# EAGLE board core+io2 (EAGLE 6.6.0), part 1 of 2
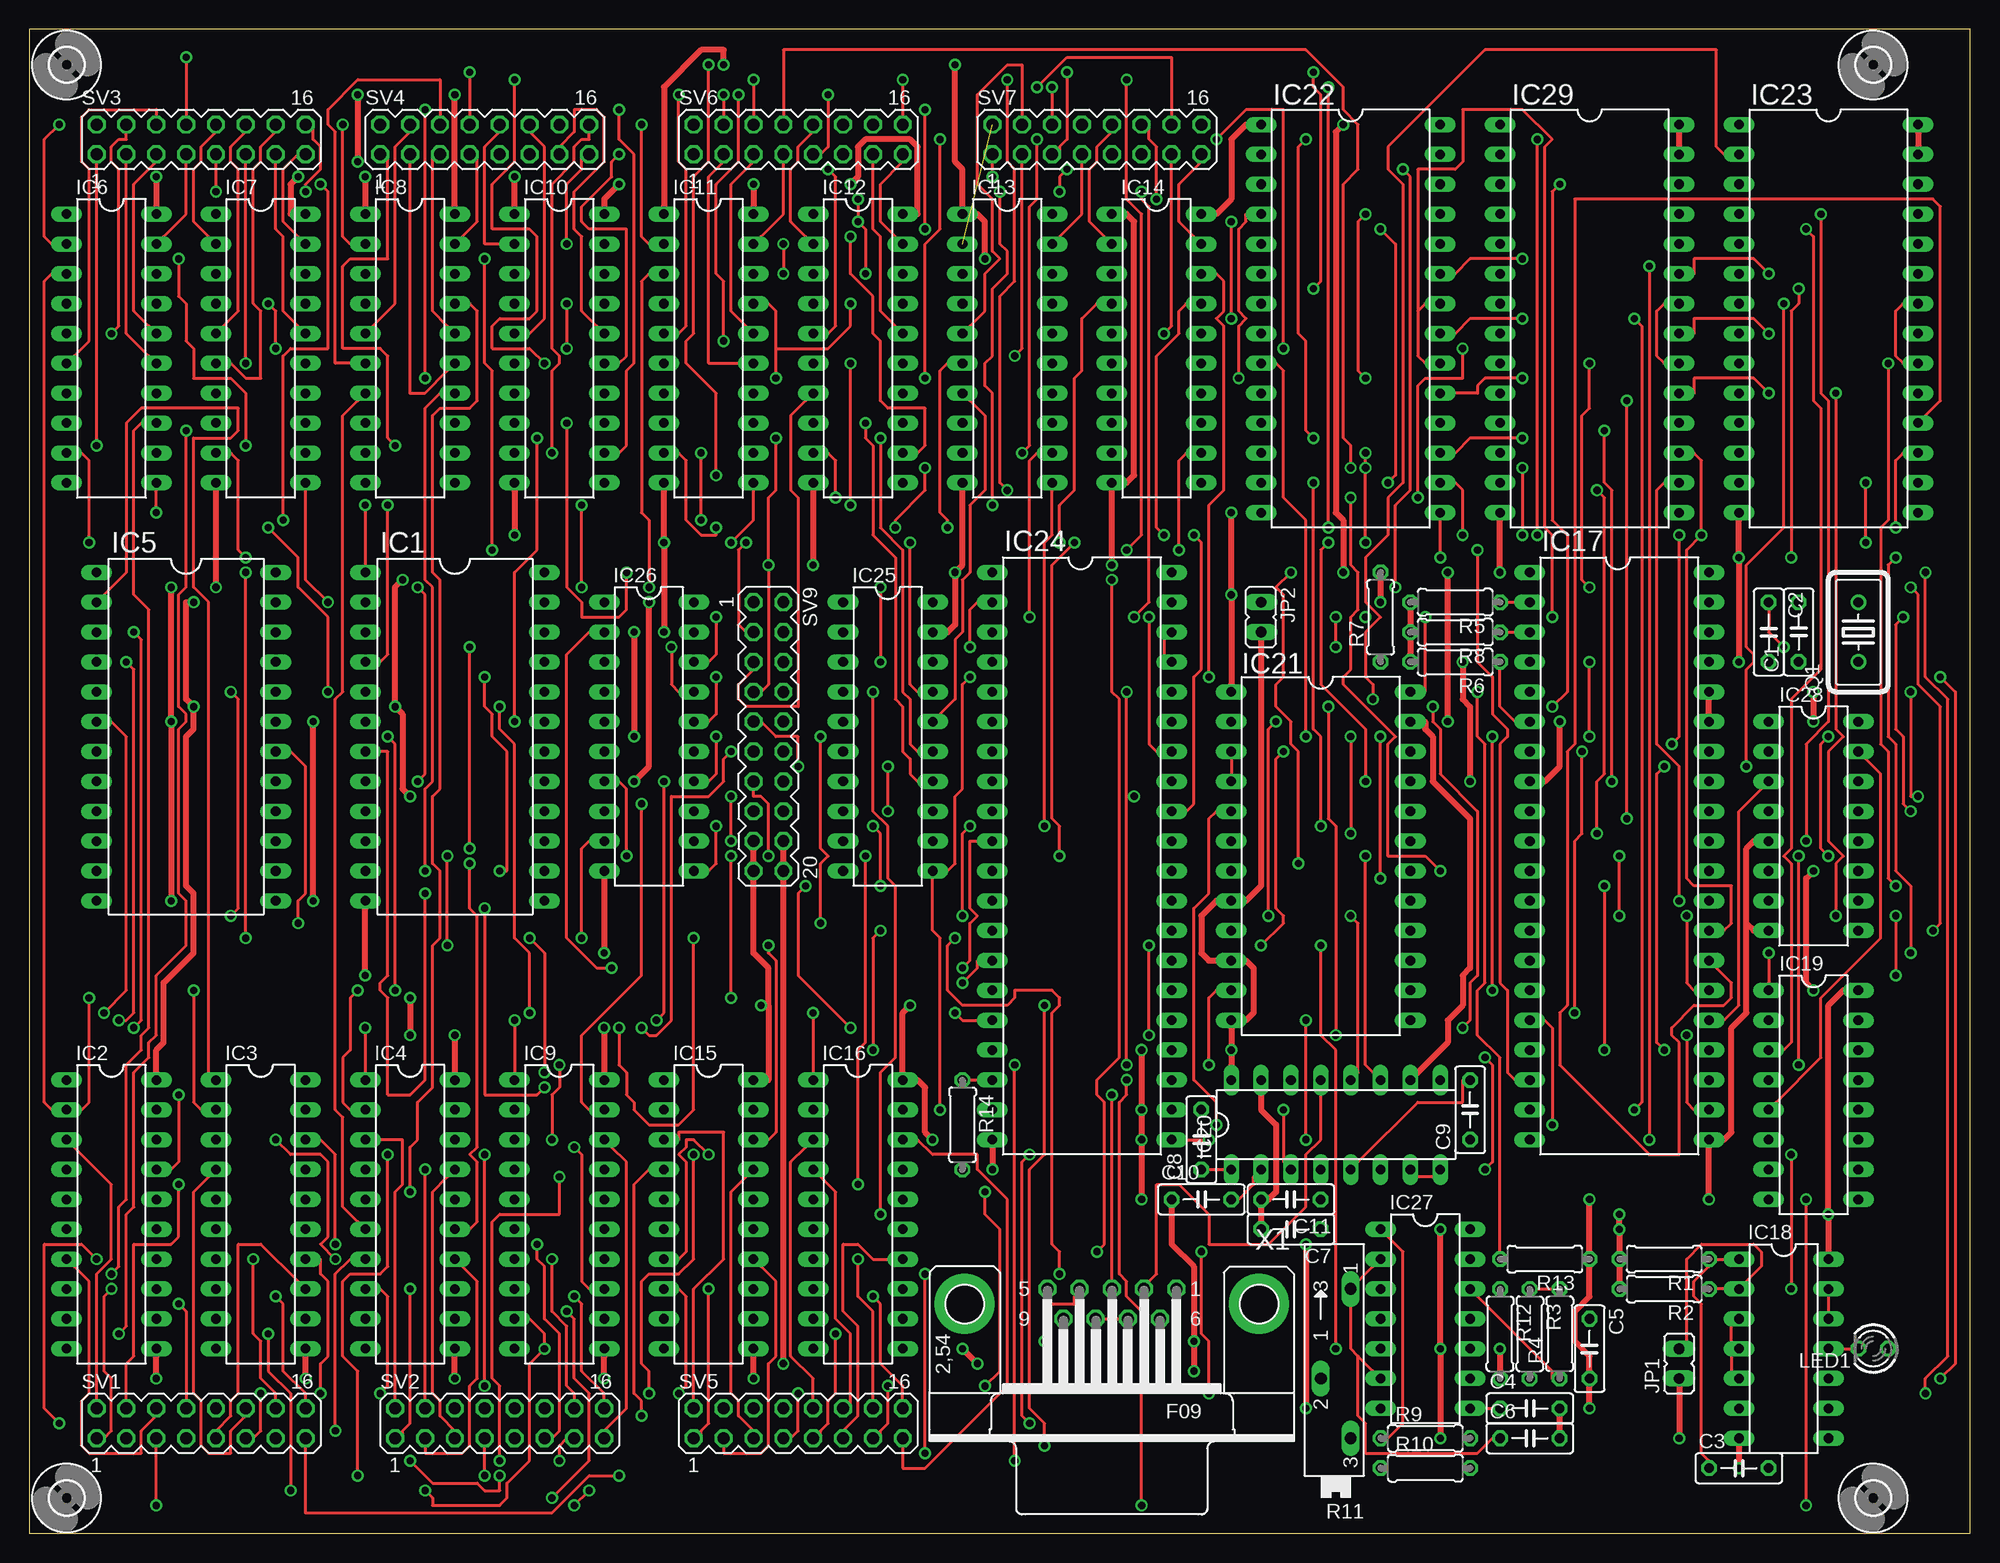
[diagram p3: board, top side]
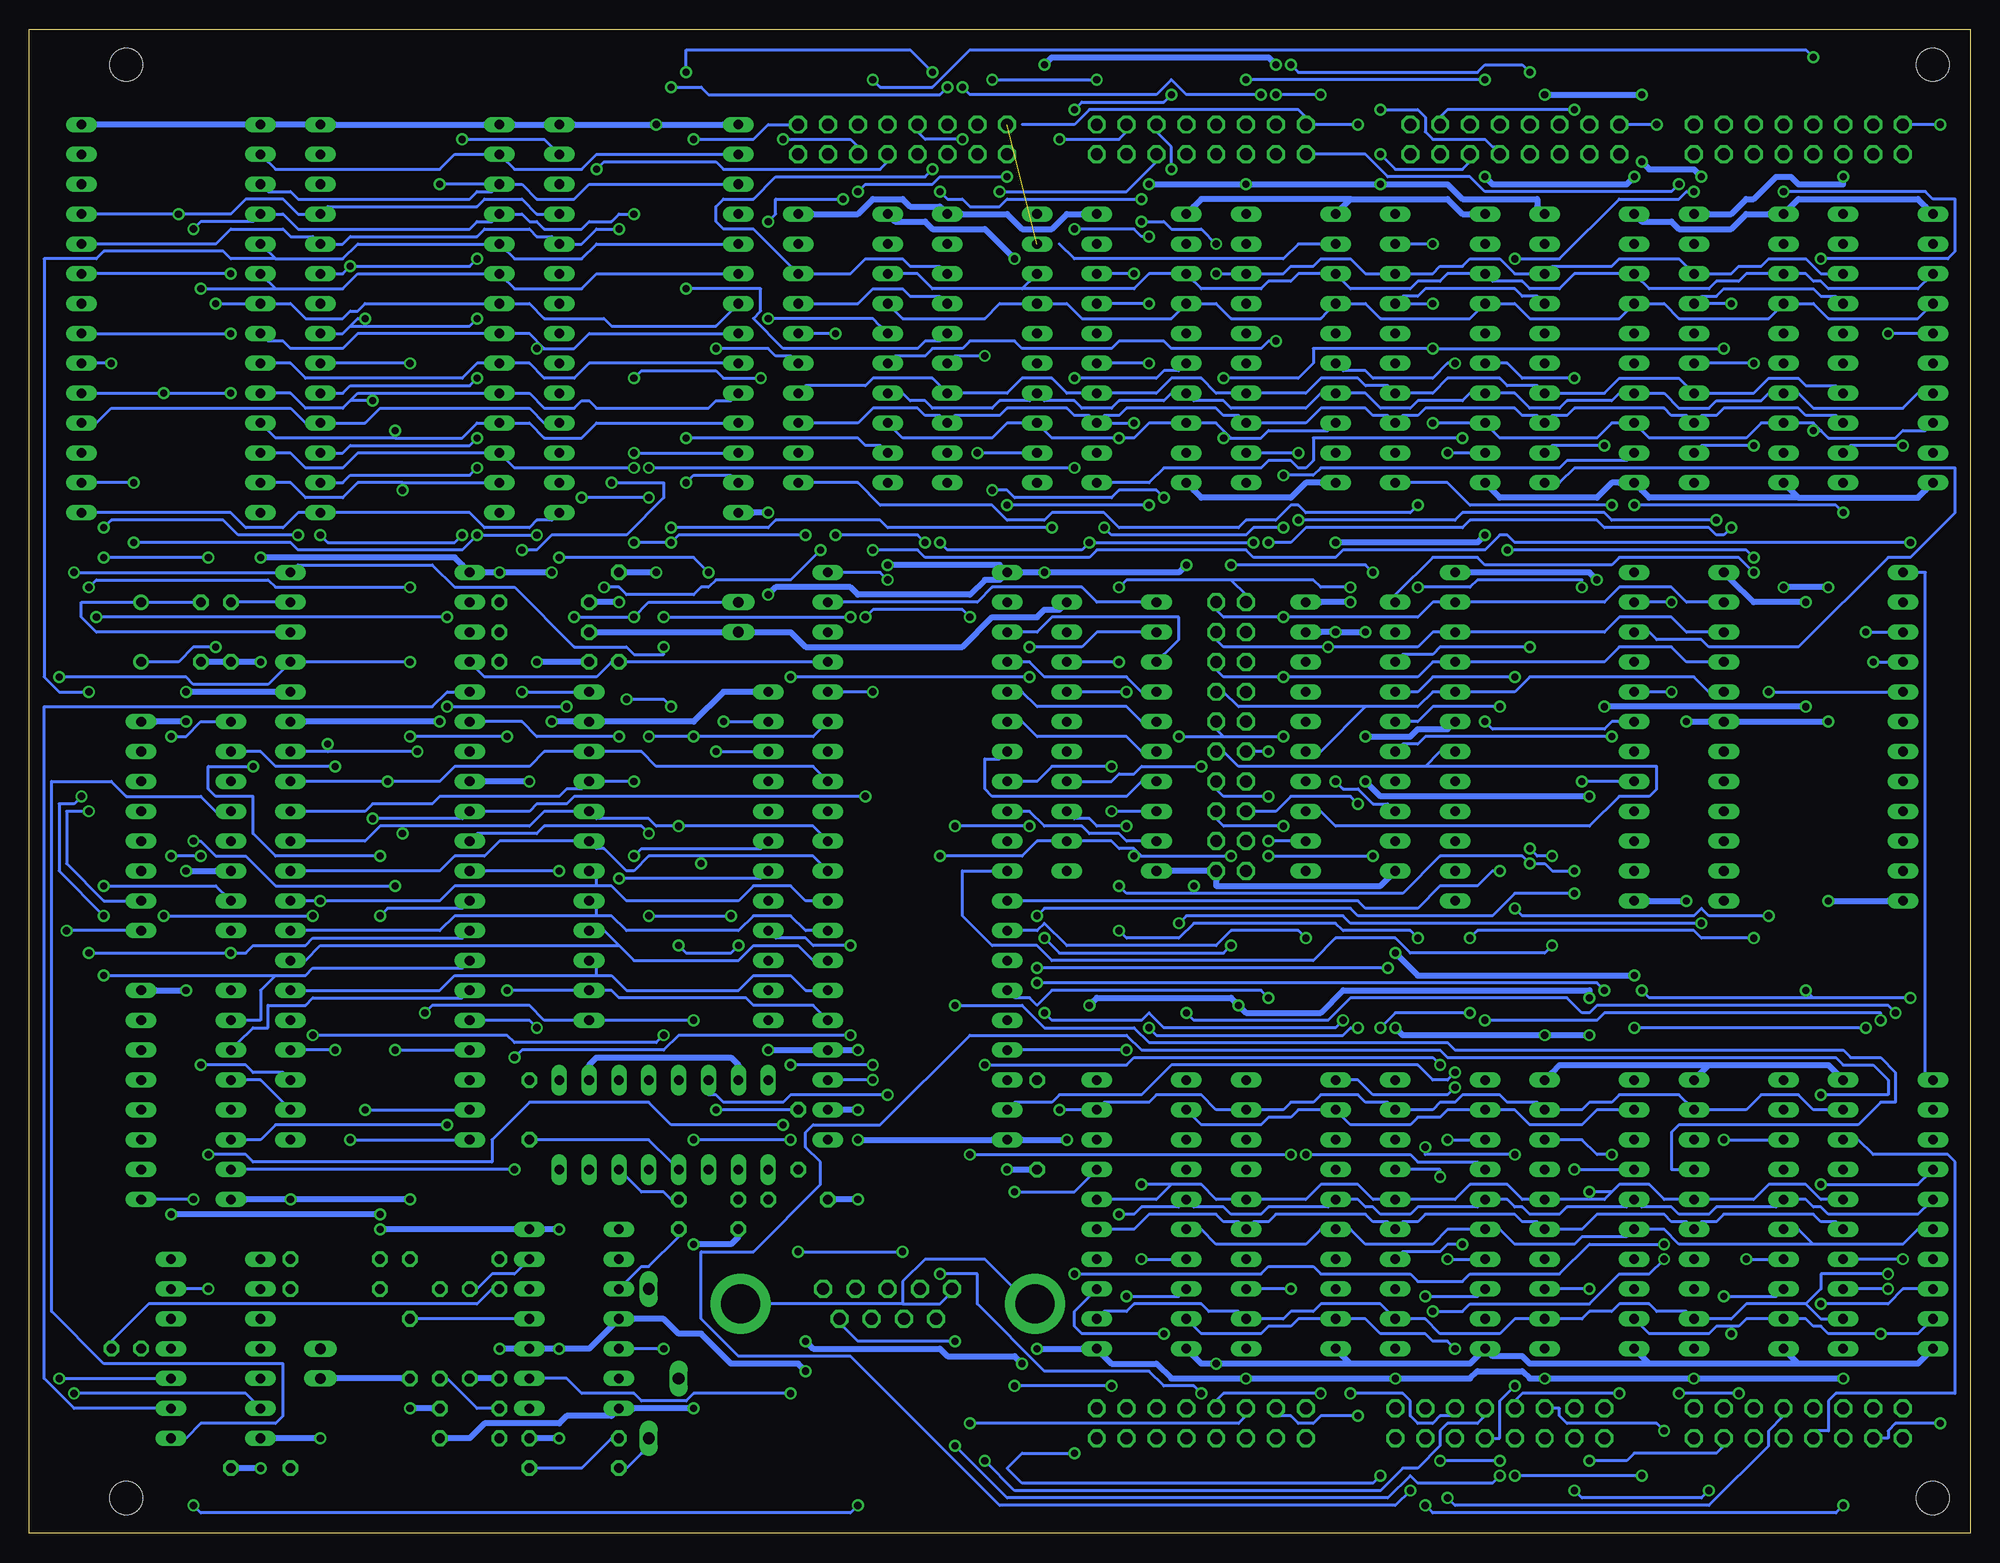
[diagram p4: board, bottom side, seen from below]

Size 165.08 x 127.94 mm. Coordinates in mm from the lower left corner, seen from the top.
Outline: 0,0 165.08,0 165.08,127.94 0,127.94 0,0
Copper layers (1*16): Top 0.035mm / dielectric 1.5mm / Bottom 0.035mm
Design rules "default": minimum track width 10mil, minimum drill 24mil, track to track 8mil, track to pad 8mil, pad to pad 8mil, via to via 8mil, smd to smd 8mil, copper to edge 40mil, drill to drill 8mil, minimum pad ring 10mil, minimum via ring 8mil, stop-mask expansion 4mil, vias tented up to drill 0mil, thermal gap 10mil
Net classes: 1 Power: width 0.508 mm, drill 0.254 mm, clearance 0.254 mm

## Footprints (pad centres in the part's own frame; a part is rotated, then mirrored left to right if it is on the bottom)
C050-025X075 = drill 0.813 octagon: 1 -2.54,0; 2 2.54,0
DIL24-6 = drill 0.813 long: 1 -13.97,-7.62; 2 -11.43,-7.62; 3 -8.89,-7.62; 4 -6.35,-7.62; 5 -3.81,-7.62; 6 -1.27,-7.62; 7 1.27,-7.62; 8 3.81,-7.62; 9 6.35,-7.62; 10 8.89,-7.62; 11 11.43,-7.62; 12 13.97,-7.62; 13 13.97,7.62; 14 11.43,7.62; 15 8.89,7.62; 16 6.35,7.62; 17 3.81,7.62; 18 1.27,7.62; 19 -1.27,7.62; 20 -3.81,7.62; 21 -6.35,7.62; 22 -8.89,7.62; 23 -11.43,7.62; 24 -13.97,7.62
DIL20 = drill 0.813 long: 1 -11.43,-3.81; 2 -8.89,-3.81; 3 -6.35,-3.81; 4 -3.81,-3.81; 5 -1.27,-3.81; 6 1.27,-3.81; 7 3.81,-3.81; 8 6.35,-3.81; 9 8.89,-3.81; 10 11.43,-3.81; 11 11.43,3.81; 12 8.89,3.81; 13 6.35,3.81; 14 3.81,3.81; 15 1.27,3.81; 16 -1.27,3.81; 17 -3.81,3.81; 18 -6.35,3.81; 19 -8.89,3.81; 20 -11.43,3.81
DIL40 = drill 0.813 long: 1 -24.13,-7.62; 2 -21.59,-7.62; 3 -19.05,-7.62; 4 -16.51,-7.62; 5 -13.97,-7.62; 6 -11.43,-7.62; 7 -8.89,-7.62; 8 -6.35,-7.62; 9 -3.81,-7.62; 10 -1.27,-7.62; 11 1.27,-7.62; 12 3.81,-7.62; 13 6.35,-7.62; 14 8.89,-7.62; 15 11.43,-7.62; 16 13.97,-7.62; 17 16.51,-7.62; 18 19.05,-7.62; 19 21.59,-7.62; 20 24.13,-7.62; 21 24.13,7.62; 22 21.59,7.62; 23 19.05,7.62; 24 16.51,7.62; 25 13.97,7.62; 26 11.43,7.62; 27 8.89,7.62; 28 6.35,7.62; 29 3.81,7.62; 30 1.27,7.62; 31 -1.27,7.62; 32 -3.81,7.62; 33 -6.35,7.62; 34 -8.89,7.62; 35 -11.43,7.62; 36 -13.97,7.62; 37 -16.51,7.62; 38 -19.05,7.62; 39 -21.59,7.62; 40 -24.13,7.62
DIL14 = drill 0.813 long: 1 -7.62,-3.81; 2 -5.08,-3.81; 3 -2.54,-3.81; 4 0,-3.81; 5 2.54,-3.81; 6 5.08,-3.81; 7 7.62,-3.81; 8 7.62,3.81; 9 5.08,3.81; 10 2.54,3.81; 11 0,3.81; 12 -2.54,3.81; 13 -5.08,3.81; 14 -7.62,3.81
DIL16 = drill 0.813 long: 1 -8.89,-3.81; 2 -6.35,-3.81; 3 -3.81,-3.81; 4 -1.27,-3.81; 5 1.27,-3.81; 6 3.81,-3.81; 7 6.35,-3.81; 8 8.89,-3.81; 9 8.89,3.81; 10 6.35,3.81; 11 3.81,3.81; 12 1.27,3.81; 13 -1.27,3.81; 14 -3.81,3.81; 15 -6.35,3.81; 16 -8.89,3.81
DIL24 = drill 0.813 long: 1 -13.97,-7.62; 2 -11.43,-7.62; 3 -8.89,-7.62; 4 -6.35,-7.62; 5 -3.81,-7.62; 6 -1.27,-7.62; 7 1.27,-7.62; 8 3.81,-7.62; 9 6.35,-7.62; 10 8.89,-7.62; 11 11.43,-7.62; 12 13.97,-7.62; 13 13.97,7.62; 14 11.43,7.62; 15 8.89,7.62; 16 6.35,7.62; 17 3.81,7.62; 18 1.27,7.62; 19 -1.27,7.62; 20 -3.81,7.62; 21 -6.35,7.62; 22 -8.89,7.62; 23 -11.43,7.62; 24 -13.97,7.62
DIL28 = drill 0.813 long: 1 -16.51,-7.62; 2 -13.97,-7.62; 3 -11.43,-7.62; 4 -8.89,-7.62; 5 -6.35,-7.62; 6 -3.81,-7.62; 7 -1.27,-7.62; 8 1.27,-7.62; 9 3.81,-7.62; 10 6.35,-7.62; 11 8.89,-7.62; 12 11.43,-7.62; 13 13.97,-7.62; 14 16.51,-7.62; 15 16.51,7.62; 16 13.97,7.62; 17 11.43,7.62; 18 8.89,7.62; 19 6.35,7.62; 20 3.81,7.62; 21 1.27,7.62; 22 -1.27,7.62; 23 -3.81,7.62; 24 -6.35,7.62; 25 -8.89,7.62; 26 -11.43,7.62; 27 -13.97,7.62; 28 -16.51,7.62
JP1 = drill 0.914 long: 1 0,-1.27; 2 0,1.27
LED3MM = drill 0.813 octagon: A -1.27,0; K 1.27,0
HC18U-V = drill 0.813: 1 -2.54,0; 2 2.54,0
0207/7 = drill 0.813 octagon: 1 -3.81,0; 2 3.81,0
SP19L = drill 1.016 long: A 5.715,-1.27; E -6.985,-1.27; S -1.905,1.27
MA08-2 = drill 1.016 octagon: 1 -8.89,-1.27; 2 -8.89,1.27; 3 -6.35,-1.27; 4 -6.35,1.27; 5 -3.81,-1.27; 6 -3.81,1.27; 7 -1.27,-1.27; 8 -1.27,1.27; 9 1.27,-1.27; 10 1.27,1.27; 11 3.81,-1.27; 12 3.81,1.27; 13 6.35,-1.27; 14 6.35,1.27; 15 8.89,-1.27; 16 8.89,1.27
MA10-2 = drill 1.016 octagon: 1 -11.43,-1.27; 2 -11.43,1.27; 3 -8.89,-1.27; 4 -8.89,1.27; 5 -6.35,-1.27; 6 -6.35,1.27; 7 -3.81,-1.27; 8 -3.81,1.27; 9 -1.27,-1.27; 10 -1.27,1.27; 11 1.27,-1.27; 12 1.27,1.27; 13 3.81,-1.27; 14 3.81,1.27; 15 6.35,-1.27; 16 6.35,1.27; 17 8.89,-1.27; 18 8.89,1.27; 19 11.43,-1.27; 20 11.43,1.27
2,8 = hole 2.8: 0,0
F09HP = drill 1.016 octagon: 1 -5.486,-1.27; 2 -2.743,-1.27; 3 0,-1.27; 4 2.743,-1.27; 5 5.486,-1.27; 6 -4.115,1.27; 7 -1.372,1.27; 8 1.372,1.27; 9 4.115,1.27 | drill 3.302 pad 5.08: G1 -12.522,0; G2 12.522,0

## Placement (x,y rotation side)
C1  27pf  [C050-025X075]  150.49,76.67 90 top
C2  27pf  [C050-025X075]  147.95,76.67 270 top
C3  22uf  [C050-025X075]  145.41,5.55 0 top
C4  0.1uf  [C050-025X075]  127.63,10.63 0 top
C5  10uf  [C050-025X075]  132.71,15.71 270 top
C6  330pf  [C050-025X075]  127.63,8.09 0 top
C7  10uf  [C050-025X075]  107.31,25.87 180 top
C8  0.1uf  [C050-025X075]  99.69,33.49 90 top
C9  0.1uf  [C050-025X075]  122.55,36.03 90 top
C10  0.1uf  [C050-025X075]  99.69,28.41 0 top
C11  0.1uf  [C050-025X075]  107.31,28.41 180 top
IC1  74154N  [DIL24-6]  36.19,67.78 270 top
IC2  74LS373N  [DIL20]  6.98,27.14 270 top
IC3  74LS373N  [DIL20]  19.68,27.14 270 top
IC4  74LS373N  [DIL20]  32.38,27.14 270 top
IC5  74154N  [DIL24-6]  13.33,67.78 270 top
IC6  74LS374N  [DIL20]  6.98,100.8 270 top
IC7  74LS374N  [DIL20]  19.68,100.8 270 top
IC8  74LS374N  [DIL20]  32.38,100.8 270 top
IC9  74LS373N  [DIL20]  45.08,27.14 270 top
IC10  74LS374N  [DIL20]  45.08,100.8 270 top
IC11  74LS374N  [DIL20]  57.78,100.8 270 top
IC12  74LS374N  [DIL20]  70.48,100.8 270 top
IC13  74LS374N  [DIL20]  83.18,100.8 270 top
IC14  74LS374N  [DIL20]  95.88,100.8 270 top
IC15  74LS373N  [DIL20]  57.78,27.14 270 top
IC16  74LS373N  [DIL20]  70.48,27.14 270 top
IC17  [DIL40]  135.25,57.62 270 top
IC18  74LS00N  [DIL14]  149.22,15.71 270 top
IC19  74LS138N  [DIL16]  151.76,37.3 270 top
IC20  MAX232  [DIL16]  111.12,34.76 0 top
IC21  [DIL24]  109.85,57.62 270 top
IC22  5565  [DIL28]  112.39,103.34 270 top
IC23  2764  [DIL28]  153.03,103.34 270 top
IC24  [DIL40]  89.53,57.62 270 top
IC25  74LS245N  [DIL20]  73.02,67.78 270 top
IC26  74LS245N  [DIL20]  52.7,67.78 270 top
IC27  LM556N  [DIL14]  118.74,18.25 270 top
IC28  74LS138N  [DIL16]  151.76,60.16 270 top
IC29  2764  [DIL28]  132.71,103.34 270 top
JP1  RESET  [JP1]  140.33,14.44 0 top
JP2  DEBUG  [JP1]  104.77,77.94 180 top
LED1  [LED3MM]  156.84,15.71 180 top
Q1  4Mhz  [HC18U-V]  155.57,76.67 90 top
R1  10K  [0207/7]  139.06,23.33 180 top
R2  10K  [0207/7]  139.06,20.79 180 top
R3  100K  [0207/7]  127.63,16.98 270 top
R4  100K  [0207/7]  130.17,16.98 90 top
R5  3.3K  [0207/7]  121.28,79.21 180 top
R6  3.3K  [0207/7]  121.28,74.13 180 top
R7  3.3K  [0207/7]  114.93,77.94 90 top
R8  3.3K  [0207/7]  121.28,76.67 180 top
R9  1.8K  [0207/7]  118.74,8.09 0 top
R10  10K  [0207/7]  118.74,5.55 0 top
R11  10K  [SP19L]  111.12,15.08 90 top
R12  270  [0207/7]  125.09,16.98 270 top
R13  1K  [0207/7]  128.9,23.33 180 top
R14  3.3K  [0207/7]  79.37,34.76 270 top
SV1  [MA08-2]  14.6,9.36 0 top
SV2  [MA08-2]  40,9.36 0 top
SV3  [MA08-2]  14.6,118.58 0 top
SV4  [MA08-2]  38.73,118.58 0 top
SV5  [MA08-2]  65.4,9.36 0 top
SV6  [MA08-2]  65.4,118.58 0 top
SV7  [MA08-2]  90.8,118.58 0 top
SV9  [MA10-2]  62.86,67.78 270 top
U$1  [2,8]  156.84,3.01 0 top
U$2  [2,8]  156.84,124.93 0 top
U$3  [2,8]  3.17,124.93 0 top
U$4  [2,8]  3.17,3.01 0 top
X1  [F09HP]  92.07,19.52 180 top

## Tracks (layer width: path | path; a pad name or v marks a point on that pad's centre or on a via)
!AB  (via drill 0.61)
  Top 0.254: 118.1,103.97 118.74,104.61 IC22.22 | 118.1,103.97 118.1,100.16 118.74,99.53 IC22.20 | v160.01,61.43 159.38,62.06 159.38,67.78 158.75,68.41 158.75,77.3 v159.38,77.94 | v129.53,77.94 129.53,84.92 128.9,85.56 128.9,117.94 129.53,118.58 126.99,121.12 121.91,121.12 121.91,116.67 121.28,116.04 118.1,116.04 118.1,103.97
  Bottom 0.254: v160.01,61.43 161.92,61.43 161.92,56.98 158.75,53.81 156.84,53.81 IC28.10 | v129.53,77.94 v159.38,77.94
!CD  (via drill 0.61)
  Top 0.254: IC29.22 139.06,104.61 138.42,103.97 138.42,100.16 139.06,99.53 IC29.20 | v161.92,51.27 162.56,51.91 162.56,70.32 160.65,72.22 160.65,79.84 v160.01,80.48 | v132.71,80.48 132.07,81.11 132.07,95.08 132.71,95.72 v132.71,99.53
  Bottom 0.254: v161.92,51.27 156.84,51.27 IC28.9 | v160.01,80.48 159.38,81.11 144.78,81.11 144.14,80.48 v132.71,80.48 | v132.71,99.53 139.06,99.53 IC29.20
!EF  (via drill 0.61)
  Top 0.254: IC23.22 159.38,104.61 158.75,103.97 158.75,100.16 159.38,99.53 IC23.20 | v158.75,55.08 158.11,55.71 158.11,66.51 157.47,67.14 157.47,85.56 158.11,86.19 v158.11,99.53
  Bottom 0.254: v158.75,55.08 149.22,55.08 148.59,54.45 IC28.7 | v158.11,99.53 159.38,99.53 IC23.20
!HLT
  Top 0.254: R5.1 125.72,79.21 126.36,79.21 IC17.2
!IO-E  (via drill 0.61)
  Top 0.254: v93.34,38.57 93.34,37.3 92.7,36.66 92.7,22.06 93.34,21.42 93.34,20.15 94.61,18.88 v94.61,2.38 | v151.12,2.38 v151.12,28.41
  Bottom 0.254: v93.34,38.57 95.88,38.57 IC24.23 | v94.61,2.38 95.24,1.74 150.49,1.74 v151.12,2.38 | v151.12,28.41 154.3,28.41 IC19.9
!IO-F  (via drill 0.61)
  Top 0.254: v95.24,42.38 v95.24,50 | v123.82,40.48 124.45,39.84 124.45,31.58 v123.82,30.95
  Bottom 0.254: v95.24,50 98.42,50 99.05,50.63 101.59,50.63 IC21.9 | v95.24,42.38 109.85,42.38 111.12,41.11 123.19,41.11 v123.82,40.48 | v123.82,30.95 146.68,30.95 IC19.7
!IRQ
  Top 0.254: IC24.37 96.52,74.77 96.52,76.03 IC24.38
  Bottom 0.254: IC24.37 98.42,74.13 114.3,74.13 R7.1 115.56,74.13 116.83,72.86 126.36,72.86 126.99,73.5 IC17.4
!NMI  (via drill 0.61)
  Top 0.254: IC17.6 126.36,69.05 125.09,70.32 125.09,73.5 R6.1 | v114.93,55.71 v114.93,67.78
  Bottom 0.254: v114.93,55.71 102.86,55.71 IC21.7 | v114.93,67.78 121.91,67.78 123.19,69.05 126.36,69.05 IC17.6
!RST  (via drill 0.61)
  Top 0.254: v161.28,11.9 161.28,13.17 163.19,15.08 163.19,70.95 161.28,72.86 v161.28,81.75 | v95.24,77.94 95.24,67.14 95.88,66.51 IC24.34 | v111.12,75.4 v111.12,77.94
  Bottom 0.254: v161.28,11.9 146.68,11.9 146.04,11.27 IC18.6 | v161.28,81.75 144.14,81.75 IC17.40 142.23,82.39 130.81,82.39 128.9,80.48 123.82,80.48 118.74,75.4 114.3,75.4 113.66,74.77 111.12,74.77 v111.12,75.4 | v95.24,77.94 102.86,77.94 v111.12,77.94
A00  (via drill 0.61)
  Top 0.254: v93.34,39.84 93.34,62.7 | 93.34,62.7 v93.34,71.59 | v100.32,39.84 100.32,45.55 100.96,46.19 IC21.11 | v135.88,60.8 v135.88,96.36 | 93.34,62.7 v93.97,62.7
  Bottom 0.254: v93.34,71.59 95.88,71.59 IC24.36 | v93.34,39.84 v100.32,39.84 | 137.79,96.36 138.42,95.72 141.6,95.72 142.87,96.99 144.14,96.99 IC23.10 | 137.79,96.36 137.16,96.99 126.36,96.99 IC29.10 123.82,96.99 122.55,96.99 121.28,95.72 118.74,95.72 118.1,96.36 117.47,96.36 116.83,95.72 107.31,95.72 106.67,96.36 105.41,96.36 IC22.10 | v135.88,60.8 128.27,60.8 IC17.9 126.36,61.43 122.55,61.43 121.91,62.06 119.38,62.06 118.74,62.7 v93.97,62.7 | v135.88,96.36 137.79,96.36
A01  (via drill 0.61)
  Top 0.254: v112.39,67.78 v112.39,59.52 | v108.58,67.78 108.58,86.19 106.67,88.1 106.67,98.89 106.04,99.53 IC22.9
  Bottom 0.254: v112.39,67.78 v108.58,67.78 98.42,67.78 97.78,68.41 IC24.35 | v112.39,59.52 113.02,60.16 121.28,60.16 121.91,59.52 126.99,59.52 IC17.10 | IC23.9 144.14,99.53 142.87,99.53 141.6,98.26 128.27,98.26 126.99,99.53 126.36,99.53 IC29.9 123.82,99.53 122.55,99.53 121.28,98.26 118.74,98.26 117.47,99.53 106.04,99.53 IC22.9
A02  (via drill 0.61)
  Top 0.254: v120.01,56.35 118.74,57.62 115.56,57.62 115.56,67.14 116.2,67.78 111.75,72.22 111.75,72.86 112.39,73.5 112.39,77.94 113.02,78.58 113.02,81.75 112.39,82.39 v112.39,88.1 | v118.1,88.1 118.1,97.62 118.74,98.26 121.91,98.26 v121.91,100.8
  Bottom 0.254: 121.28,100.8 118.74,100.8 117.47,102.07 106.04,102.07 IC22.8 | 121.28,100.8 122.55,102.07 123.82,102.07 IC29.8 126.36,102.07 137.16,102.07 138.42,100.8 142.87,100.8 143.5,101.44 144.78,101.44 IC23.8 | v120.01,56.35 126.36,56.35 IC17.11 | v112.39,88.1 v118.1,88.1 | v121.91,100.8 121.28,100.8
A03  (via drill 0.61)
  Top 0.254: v135.25,52.54 v135.25,57.62 | v146.04,65.24 146.04,73.5 146.68,74.13 146.68,74.77 146.04,75.4 146.04,82.39 149.22,85.56 v149.22,104.61
  Bottom 0.254: IC22.7 105.41,103.97 106.67,102.7 115.56,102.7 116.2,103.34 121.28,103.34 122.55,104.61 123.82,104.61 IC29.7 126.36,104.61 136.52,104.61 137.16,103.97 137.79,103.97 138.42,103.34 141.6,103.34 142.87,104.61 144.14,104.61 IC23.7 146.68,104.61 v149.22,104.61 | v135.25,52.54 134.62,53.17 128.27,53.17 IC17.12 | v135.25,57.62 144.14,57.62 146.04,59.52 146.04,62.7 149.22,62.7 149.85,63.34 149.85,65.24 v146.04,65.24
A04  (via drill 0.61)
  Top 0.254: v147.95,49.37 147.95,46.82 IC19.1 | v160.01,49.37 160.01,55.08 158.75,56.35 158.75,67.14 158.11,67.78 158.11,82.39 v158.75,83.02 | v149.85,83.02 149.85,103.97 150.49,104.61 v150.49,105.88
  Bottom 0.254: IC17.13 128.27,50.63 140.97,50.63 141.6,50 146.04,50 146.68,49.37 v147.95,49.37 v160.01,49.37 | IC22.6 106.04,107.15 116.83,107.15 118.1,105.88 123.82,105.88 124.45,106.52 IC29.6 126.36,107.15 137.16,107.15 138.42,105.88 144.14,105.88 | 144.14,105.88 144.78,106.52 IC23.6 | v149.85,83.02 v158.75,83.02 | v150.49,105.88 144.14,105.88
A05  (via drill 0.61)
  Top 0.254: v158.75,52.54 v158.75,47.46 | v160.65,62.7 160.01,62.7 v160.01,71.59
  Bottom 0.254: 144.14,47.46 141.6,47.46 140.97,48.09 128.27,48.09 IC17.14 | 144.14,47.46 145.41,46.19 145.41,43.65 146.68,43.65 IC19.2 | IC22.5 106.04,109.69 116.83,109.69 118.1,108.42 123.82,108.42 124.45,109.05 IC29.5 126.36,109.69 137.16,109.69 138.42,108.42 144.14,108.42 | 144.14,108.42 144.78,109.05 IC23.5 | v158.75,47.46 144.14,47.46 | v158.75,52.54 162.56,56.35 162.56,62.06 161.28,62.06 v160.65,62.7 | v160.01,71.59 162.56,71.59 163.82,72.86 163.82,108.42 159.38,108.42 158.75,109.05 148.59,109.05 147.95,108.42 144.14,108.42
A06  (via drill 0.61)
  Top 0.254: v102.86,98.26 102.86,102.7 103.5,103.34 102.86,103.97 102.86,110.96 103.5,111.59 103.5,112.23 IC22.4 | v113.66,98.26 113.02,98.89 113.02,111.59 v113.66,112.23 | v151.12,110.96 151.76,110.33 151.76,96.36 152.39,95.72 152.39,73.5 149.85,70.95 149.85,58.25 149.22,57.62 149.85,56.98 149.85,41.74 149.22,41.11 IC19.3
  Bottom 0.254: IC19.3 147.31,41.74 146.04,43.02 144.78,43.02 144.78,44.92 141.6,44.92 140.97,45.55 128.27,45.55 IC17.15 | v102.86,98.26 106.04,98.26 106.67,98.89 113.02,98.89 v113.66,98.26 | v113.66,112.23 114.93,112.23 115.56,111.59 117.47,111.59 118.1,110.96 121.28,110.96 121.91,111.59 122.55,111.59 123.19,112.23 123.82,112.23 IC29.4 125.72,111.59 126.99,111.59 127.63,110.96 142.23,110.96 143.5,112.23 144.14,112.23 IC23.4 146.04,111.59 150.49,111.59 v151.12,110.96
A07  (via drill 0.61)
  Top 0.254: v129.53,34.76 129.53,43.02 128.9,43.65 IC17.16 | v121.91,43.02 122.55,43.65 122.55,46.82 123.19,47.46 123.19,61.43 120.01,64.61 120.01,68.41 119.38,69.05 v119.38,70.32 | v129.53,70.32 130.81,71.59 130.81,84.92 129.53,86.19 129.53,114.14 v130.17,114.77
  Bottom 0.254: v129.53,34.76 144.14,34.76 145.41,33.49 146.68,33.49 IC19.6 | IC22.3 106.04,114.77 117.47,114.77 118.74,113.5 121.91,113.5 123.19,114.77 123.82,114.77 IC29.3 | IC23.3 144.78,114.14 142.87,114.14 142.23,113.5 127.63,113.5 126.99,114.14 125.72,114.14 IC29.3 | v121.91,43.02 122.55,43.65 126.36,43.65 IC17.16 | v129.53,70.32 v119.38,70.32 | v130.17,114.77 126.36,114.77 IC29.3
A08  (via drill 0.61)
  Top 0.254: v133.98,55.08 v133.98,41.11 | v151.12,58.89 151.12,67.14 153.03,69.05 153.03,96.36 152.39,96.99 v152.39,112.23
  Bottom 0.254: IC22.25 121.28,112.23 121.91,112.23 123.19,113.5 126.36,113.5 126.99,112.86 139.69,112.86 IC29.25 141.6,112.23 142.23,112.23 143.5,113.5 146.68,113.5 147.95,112.23 v152.39,112.23 159.38,112.23 IC23.25 | v133.98,41.11 128.9,41.11 IC17.17 | v133.98,55.08 144.14,55.08 146.68,57.62 149.22,57.62 150.49,58.89 v151.12,58.89
A09  (via drill 0.61)
  Top 0.254: v123.19,83.66 123.19,74.13 124.45,72.86 124.45,69.69 125.72,68.41 125.72,67.78 125.09,67.14 125.09,46.82 125.72,46.19 125.72,39.2 126.36,38.57 IC17.18 | v115.56,89.37 116.2,90 116.2,109.69 v114.93,110.96
  Bottom 0.254: v123.19,83.66 121.91,83.66 120.64,84.92 114.3,84.92 111.12,88.1 111.12,89.37 v115.56,89.37 | v114.93,110.96 116.83,110.96 118.1,109.69 118.74,109.69 IC22.24 120.64,110.33 121.91,110.33 122.55,110.96 126.36,110.96 126.99,110.33 137.79,110.33 138.42,109.69 139.06,109.69 IC29.24 140.97,110.33 142.87,110.33 143.5,110.96 147.95,110.96 149.22,109.69 159.38,109.69 IC23.24
A10  (via drill 0.61)
  Top 0.254: v136.52,36.03 137.16,36.66 137.16,102.7 v136.52,103.34 | v126.99,103.34 122.55,103.34 121.28,102.07 IC22.21 | v147.95,102.07 146.68,103.34 141.6,103.34 141.6,102.07 IC29.21
  Bottom 0.254: v136.52,36.03 128.9,36.03 IC17.19 | v136.52,103.34 137.16,103.34 137.79,102.7 | 137.79,102.7 138.42,102.07 139.06,102.07 IC29.21 | v126.99,103.34 127.63,102.7 137.79,102.7 | v147.95,102.07 159.38,102.07 IC23.21
A11  (via drill 0.61)
  Top 0.254: v137.79,107.78 v137.79,33.49 | v126.99,108.42 122.55,108.42 121.28,107.15 IC22.23 | v147.95,107.15 146.68,108.42 141.6,108.42 141.6,107.15 IC29.23
  Bottom 0.254: v137.79,33.49 128.9,33.49 IC17.20 | IC29.23 139.06,107.15 138.42,107.15 v137.79,107.78 127.63,107.78 v126.99,108.42 | v147.95,107.15 159.38,107.15 IC23.23
A12  (via drill 0.61)
  Top 0.254: v140.97,42.38 140.97,36.66 141.6,36.03 IC17.22 | v111.12,42.38 111.12,60.16 110.48,60.8 v110.48,70.32 | v114.3,70.95 114.3,72.22 113.66,72.86 113.66,76.67 114.93,77.94 113.66,79.21 113.66,83.02 115.56,84.92 115.56,88.1 116.83,89.37 116.83,114.77 115.56,116.04 115.56,117.94 123.82,126.2 143.5,126.2 143.5,117.94 144.14,117.31 IC23.2
  Bottom 0.254: IC17.22 143.5,36.66 145.41,38.57 146.68,38.57 IC19.4 | IC22.2 106.04,117.31 116.83,117.31 118.1,116.04 123.82,116.04 124.45,116.67 IC29.2 126.36,117.31 128.9,117.31 130.17,116.04 144.14,116.04 144.78,116.67 IC23.2 | v140.97,42.38 124.45,42.38 123.82,41.74 111.75,41.74 v111.12,42.38 | v110.48,70.32 111.12,70.95 v114.3,70.95
A13  (via drill 0.61)
  Top 0.254: v150.49,39.84 v150.49,57.62 | v153.03,57.62 152.39,58.25 152.39,67.14 v153.03,67.78
  Bottom 0.254: v150.49,39.84 146.68,39.84 146.04,39.2 143.5,39.2 IC17.23 | v150.49,57.62 v153.03,57.62 | v153.03,67.78 151.76,67.78 150.49,69.05 149.22,69.05 IC28.1
A14  (via drill 0.61)
  Top 0.254: v139.06,41.11 138.42,41.74 138.42,64.61 v139.06,65.24
  Bottom 0.254: v139.06,41.11 141.6,41.11 IC17.24 | v139.06,65.24 144.14,65.24 145.41,66.51 146.68,66.51 IC28.2
A15
  Top 0.254: IC17.25 144.14,43.65 145.41,44.92 145.41,61.43 147.31,63.34 IC28.3
CB1
  Top 0.254: R14.1 80,38.57 80.64,38.57 IC24.18
D0  (via drill 0.61)
  Top 0.254: v133.98,93.81 133.98,89.37 134.62,88.73 v134.62,63.97
  Bottom 0.254: IC22.11 106.04,94.45 116.83,94.45 118.1,93.18 121.28,93.18 122.55,94.45 123.82,94.45 IC29.11 126.36,94.45 126.99,94.45 128.27,93.18 133.98,93.18 | 133.98,93.18 144.14,93.18 144.78,93.81 IC23.11 | IC24.33 97.78,64.61 98.42,65.24 111.75,65.24 113.02,66.51 116.2,66.51 IC21.22 118.74,66.51 121.28,66.51 122.55,65.24 128.9,65.24 130.17,63.97 v134.62,63.97 141.6,63.97 IC17.33 | v133.98,93.81 133.98,93.18
D1  (via drill 0.61)
  Top 0.254: v99.05,84.92 99.69,84.29 99.69,73.5 99.05,72.86 99.05,62.06 98.42,61.43 IC24.32 | v113.66,91.91 v113.66,90.64 v113.66,84.29 | v113.66,63.97 113.66,68.41 109.85,72.22 109.85,83.66 v110.48,84.29
  Bottom 0.254: IC17.32 141.6,61.43 136.52,61.43 135.88,62.06 130.81,62.06 130.17,62.7 120.01,62.7 119.38,63.34 118.1,63.34 IC21.21 116.2,63.97 v113.66,63.97 | IC23.12 144.14,91.91 142.87,91.91 141.6,90.64 138.42,90.64 137.16,91.91 126.36,91.91 IC29.12 124.45,91.28 123.82,90.64 v113.66,90.64 | v99.05,84.92 109.85,84.92 v110.48,84.29 v113.66,84.29 | v113.66,91.91 106.04,91.91 IC22.12
D2  (via drill 0.61)
  Top 0.254: v109.21,89.37 109.21,68.41 109.85,67.78 v109.85,60.16 | v133.34,88.73 133.98,88.1 133.98,64.61 133.34,63.97 v133.34,59.52
  Bottom 0.254: 133.34,89.37 137.16,89.37 138.42,88.1 141.6,88.1 142.87,89.37 144.14,89.37 IC23.13 | 133.34,89.37 126.36,89.37 IC29.13 | 133.34,60.16 135.25,60.16 136.52,58.89 141.6,58.89 IC17.31 | 133.34,60.16 122.55,60.16 121.28,61.43 118.74,61.43 IC21.20 116.83,60.8 112.39,60.8 111.75,60.16 v109.85,60.16 98.42,60.16 97.78,59.52 IC24.31 | v109.21,89.37 108.58,90 105.41,90 IC22.13 | v133.34,88.73 133.34,89.37 | 133.34,60.16 v133.34,59.52
D3  (via drill 0.61)
  Top 0.254: v120.01,83.02 120.01,86.19 IC22.15 | v107.31,81.75 106.04,80.48 106.67,79.84 106.67,72.86 106.04,72.22 106.04,70.32 107.31,69.05 107.31,67.14 107.94,66.51 v107.94,56.98
  Bottom 0.254: IC22.15 120.64,86.19 121.91,86.19 122.55,85.56 126.36,85.56 127.63,86.83 139.06,86.83 IC29.15 141.6,86.83 142.23,86.83 143.5,85.56 146.68,85.56 147.95,86.83 159.38,86.83 IC23.15 | 107.94,57.62 112.39,57.62 113.66,56.35 114.3,56.35 116.2,58.25 116.83,58.25 IC21.19 118.74,58.89 125.09,58.89 126.36,57.62 128.9,57.62 130.17,56.35 141.6,56.35 IC17.30 | 107.94,57.62 98.42,57.62 97.78,56.98 IC24.30 | v120.01,83.02 108.58,83.02 v107.31,81.75 | 107.94,57.62 v107.94,56.98
D4  (via drill 0.61)
  Top 0.254: v121.91,84.92 121.91,88.73 121.28,89.37 IC22.16 | v126.99,90.64 v126.99,84.92 | v156.2,84.29 v156.2,89.37 | v140.33,53.81 140.33,65.24 138.42,67.14 138.42,88.73 139.06,89.37 IC29.16
  Bottom 0.254: v121.91,84.92 v126.99,84.92 128.27,83.66 142.23,83.66 142.87,84.29 v156.2,84.29 | v126.99,90.64 127.63,90 137.79,90 138.42,89.37 139.06,89.37 IC29.16 | v156.2,89.37 159.38,89.37 IC23.16 | 116.83,55.08 115.56,55.08 114.3,53.81 104.77,53.81 103.5,55.08 100.32,55.08 99.05,53.81 98.42,53.81 IC24.29 | 116.83,55.08 128.9,55.08 130.17,53.81 v140.33,53.81 141.6,53.81 IC17.29 | 116.83,55.08 116.83,55.71 IC21.18
D5  (via drill 0.61)
  Top 0.254: v126.99,93.18 122.55,93.18 121.28,91.91 IC22.17 | v158.75,85.56 158.75,91.28 159.38,91.91 IC23.17 | IC29.17 141.6,91.91 142.23,91.28 v142.23,84.92 140.97,83.66 140.97,55.71 141.6,55.08 144.78,55.08 144.78,51.91 144.14,51.27 IC17.28
  Bottom 0.254: v126.99,93.18 127.63,92.55 137.79,92.55 138.42,91.91 139.06,91.91 IC29.17 | v158.75,85.56 158.11,86.19 148.59,86.19 147.31,84.92 v142.23,84.92 | 116.83,52.54 115.56,52.54 114.3,51.27 104.77,51.27 103.5,52.54 100.32,52.54 99.05,51.27 98.42,51.27 IC24.28 | 116.83,52.54 128.9,52.54 130.17,51.27 141.6,51.27 IC17.28 | 116.83,52.54 116.83,53.17 IC21.17
D6
  Top 0.254: IC23.18 161.28,95.08 162.56,96.36 162.56,112.86 161.92,113.5 131.44,113.5 131.44,67.14 130.81,66.51 130.81,44.92 130.17,44.28 130.17,39.84 137.79,32.22 140.33,32.22 140.33,41.74 139.69,42.38 139.69,43.02 141.6,44.92 144.14,44.92 144.78,45.55 144.78,46.82 143.5,48.09 IC17.27
  Bottom 0.254: IC22.18 121.28,94.45 122.55,95.72 135.25,95.72 136.52,94.45 139.06,94.45 IC29.18 141.6,94.45 142.87,95.72 158.11,95.72 159.38,94.45 IC23.18 | 114.93,50 116.2,51.27 IC21.16 | 114.93,50 113.66,48.73 104.77,48.73 103.5,50 99.69,50 98.42,48.73 IC24.27 | 114.93,50 140.33,50 141.6,48.73 IC17.27
D7  (via drill 0.61)
  Top 0.254: v126.99,98.26 123.82,98.26 123.19,97.62 123.19,96.99 121.28,96.99 IC22.19 | v147.95,96.99 146.68,98.26 141.6,98.26 141.6,96.99 IC29.19 | v153.66,96.99 153.66,68.41 154.3,67.78 153.03,66.51 153.03,58.89 154.3,57.62 153.66,56.98 v153.66,52.54 | v140.97,52.54 140.97,46.82 141.6,46.19 IC17.26
  Bottom 0.254: v126.99,98.26 127.63,97.62 137.79,97.62 138.42,96.99 139.06,96.99 IC29.19 | v147.95,96.99 v153.66,96.99 159.38,96.99 IC23.19 | 116.83,47.46 115.56,47.46 114.3,46.19 104.77,46.19 103.5,47.46 100.32,47.46 99.05,46.19 98.42,46.19 IC24.26 | 116.83,47.46 128.9,47.46 130.17,46.19 141.6,46.19 IC17.26 | 116.83,47.46 116.83,48.09 IC21.15 | v153.66,52.54 v140.97,52.54
E  (via drill 0.61)
  Top 0.254: v162.56,13.17 163.82,14.44 163.82,71.59 v162.56,72.86 | v124.45,46.19 v124.45,67.78 | v132.71,67.78 v132.71,74.13
  Bottom 0.254: IC24.25 97.78,44.28 98.42,44.92 103.5,44.92 104.13,45.55 114.93,45.55 115.56,46.19 116.2,46.19 IC21.14 118.74,46.19 v124.45,46.19 | v162.56,13.17 154.3,13.17 IC18.10 | v162.56,72.86 151.76,72.86 151.12,72.22 144.78,72.22 143.5,73.5 IC17.37 141.6,74.13 v132.71,74.13 | v124.45,67.78 v132.71,67.78
GND  (via drill 0.61)
  Top 0.508: v64.13,14.44 64.13,55.71 SV9.20 64.13,56.98 64.13,58.25 SV9.18 | 146.04,51.91 146.68,51.27 IC28.8 | 146.04,51.91 146.04,58.25 146.68,58.89 IC28.5 | v132.71,28.41 132.71,23.96 R13.1 132.71,22.7 132.71,20.15 131.44,18.88 131.44,16.34 132.71,15.08 132.71,13.81 C5.2 132.71,12.54 v132.71,10.63 | v142.87,28.41 142.87,32.85 IC17.21 144.14,33.49 144.78,34.12 144.78,43.02 146.04,44.28 146.04,51.91 | C7.2 104.77,26.5 104.77,27.77 C11.2 105.41,28.41 106.04,29.04 106.04,34.76 104.77,36.03 104.77,37.3 IC20.15 | C4.2 130.17,10 130.17,8.73 C6.2 | v145.41,5.55 145.41,7.46 IC18.7 | v140.33,8.09 140.33,12.54 JP1.1 | v108.58,24.6 v108.58,10.63 | v102.23,86.83 v102.23,79.84 102.23,72.22 IC21.1 | v125.09,81.75 125.09,86.19 IC29.14 | v145.41,74.13 v145.41,83.02 145.41,86.19 IC23.14 | v120.64,69.05 v120.64,81.75 | v28.57,115.41 28.57,112.86 IC8.1 | v41.27,115.41 41.27,112.86 IC10.1 | IC25.19 78.1,76.67 78.73,77.3 v78.73,81.75 79.37,82.39 79.37,88.73 IC13.10 | v81.27,108.42 81.27,111.59 80.64,112.23 IC13.1 79.37,112.86 79.37,116.04 78.73,116.67 v78.73,124.93 | v92.07,82.39 92.07,88.73 IC14.10 93.34,89.37 93.97,90 93.97,111.59 93.34,112.23 IC14.1 | v12.06,53.81 v12.06,69.05 v12.06,80.48 | v24.12,53.81 v24.12,69.05 | v51.43,76.67 v51.43,67.78 | v53.97,76.67 v53.97,84.29 53.97,88.73 IC11.10 | v41.27,84.92 41.27,88.73 IC10.10 | v15.87,80.48 15.87,88.73 IC7.10 | v66.67,82.39 66.67,88.73 IC12.10 | v59.05,124.93 59.05,126.2 57.15,126.2 53.97,123.03 53.97,112.86 IC11.1 | IC20.10 118.1,39.2 120.64,41.74 120.64,43.65 121.91,44.92 121.91,47.46 122.55,48.09 122.55,60.8 119.38,63.97 119.38,67.78 118.74,68.41 118.74,69.05 IC21.23
  Top 0.508: v48.89,49.37 48.89,55.71 IC26.10 | v28.57,47.46 28.57,53.17 IC1.12
  Bottom 0.508: IC26.10 49.53,55.71 50.16,55.08 64.13,55.08 64.13,55.71 SV9.20 64.77,56.35 67.94,56.35 IC25.10 | 14.6,14.44 4.44,14.44 3.8,15.08 IC2.10 | 14.6,14.44 15.24,15.08 IC3.10 | 27.3,14.44 27.93,15.08 IC4.10 | 14.6,14.44 27.3,14.44 | 27.3,14.44 37.46,14.44 38.1,15.08 40.64,15.08 IC9.10 41.91,15.08 42.54,14.44 52.7,14.44 | 52.7,14.44 53.34,15.08 IC15.10 | 52.7,14.44 v64.13,14.44 65.4,14.44 66.03,15.08 IC16.10 | v132.71,28.41 v142.87,28.41 146.68,28.41 IC19.8 | IC20.15 104.77,39.84 105.41,40.48 116.83,40.48 117.47,39.84 IC20.10 | C6.2 129.53,8.09 127.63,8.09 126.36,9.36 120.01,9.36 119.38,10 115.56,10 IC27.7 113.66,10.63 v108.58,10.63 | v145.41,5.55 147.31,5.55 C3.2 | 139.06,13.17 133.34,13.17 C5.2 | 139.06,13.17 139.69,13.17 | v140.33,8.09 144.14,8.09 IC18.7 | v132.71,10.63 130.81,10.63 C4.2 | v108.58,24.6 105.41,24.6 104.77,25.23 C7.2 | v102.23,86.83 103.5,86.83 IC22.14 | IC21.1 103.5,71.59 106.04,71.59 108.58,69.05 116.2,69.05 IC21.23 118.74,69.05 v120.64,69.05 | C1.1 149.85,74.13 148.59,74.13 C2.2 147.31,74.13 v145.41,74.13 | v145.41,83.02 128.9,83.02 128.27,82.39 IC17.1 126.36,81.75 v125.09,81.75 v120.64,81.75 | IC6.1 3.8,112.86 4.44,113.5 14.6,113.5 15.24,112.86 IC7.1 17.14,112.23 19.04,112.23 20.31,110.96 24.76,110.96 25.39,111.59 27.93,111.59 IC8.1 | 52.7,113.5 44.45,113.5 43.18,112.23 42.54,112.23 IC10.1 | 52.7,113.5 53.34,112.86 IC11.1 | 52.7,113.5 65.4,113.5 66.03,112.86 IC12.1 | v28.57,115.41 29.2,114.77 40.64,114.77 v41.27,115.41 | v81.27,108.42 83.81,110.96 88.26,110.96 88.89,111.59 91.44,111.59 IC14.1 | v92.07,82.39 82.55,82.39 IC24.1 | IC24.1 80.64,81.75 v78.73,81.75 67.3,81.75 v66.67,82.39
  Bottom 0.508: v12.06,53.81 6.98,53.81 IC5.12 | v12.06,69.05 19.68,69.05 IC5.19 22.22,69.05 v24.12,69.05 | v24.12,53.81 27.3,53.81 IC1.12 | 14.6,88.1 4.44,88.1 3.8,88.73 IC6.10 | 14.6,88.1 15.24,88.73 IC7.10 | 14.6,88.1 27.3,88.1 27.93,88.73 IC8.10 29.84,89.37 30.47,89.37 31.74,88.1 40,88.1 40.64,88.73 IC10.10 | v51.43,67.78 47.62,67.78 46.98,68.41 44.45,68.41 IC1.19 | v51.43,76.67 v53.97,76.67 55.24,76.67 IC26.19 | IC12.10 66.03,88.73 65.4,88.1 57.78,88.1 56.51,89.37 55.24,89.37 IC11.10 | v41.27,84.92 41.91,84.29 v53.97,84.29 | v12.06,80.48 v15.87,80.48 | v59.05,124.93 59.69,125.56 78.1,125.56 v78.73,124.93 | v102.23,79.84 101.59,80.48 95.24,80.48 94.61,79.84 85.08,79.84 83.81,81.11 82.55,81.11 IC24.1 | v48.89,49.37 46.98,47.46 v28.57,47.46 | 139.06,13.17 JP1.1
IN00
  Bottom 0.254: IC2.1 3.8,39.2 3.8,81.75 4.44,81.75 IC5.1
IN01
  Top 0.254: IC5.2 6.34,79.84 8.25,81.75 8.25,94.45 9.52,95.72 17.77,95.72 17.77,93.81 17.14,93.18 13.97,93.18 13.97,80.48 15.24,79.21 15.24,39.2 IC3.1
IN02  (via drill 0.61)
  Top 0.254: v28.57,43.02 28.57,39.2 IC4.1 | v8.89,43.02 9.52,43.65 9.52,76.03 v8.89,76.67
  Bottom 0.254: v8.89,43.02 v28.57,43.02 | v8.89,76.67 6.98,76.67 IC5.3
IN03  (via drill 0.61)
  Top 0.254: v8.25,74.13 8.89,73.5 8.89,44.28 8.25,43.65 v7.62,43.65 | v41.27,43.65 41.27,39.2 IC9.1
  Bottom 0.254: v8.25,74.13 6.98,74.13 IC5.4 | v7.62,43.65 7.62,44.28 31.11,44.28 31.74,43.65 v41.27,43.65
IN04  (via drill 0.61)
  Top 0.254: v43.81,37.94 43.18,37.3 38.73,37.3 v38.73,53.17 | v17.14,52.54 17.77,53.17 17.77,70.95 v17.14,71.59
  Bottom 0.254: v43.81,37.94 44.45,37.3 50.8,37.3 52.07,38.57 52.7,38.57 IC15.1 | v38.73,53.17 38.1,52.54 23.49,52.54 22.86,53.17 22.22,52.54 v17.14,52.54 | v17.14,71.59 6.98,71.59 IC5.5
IN05  (via drill 0.61)
  Top 0.254: v6.34,44.28 8.25,46.19 8.25,67.78 6.98,69.05 IC5.6 | v66.67,44.28 66.67,39.2 IC16.1
  Bottom 0.254: v6.34,44.28 6.98,44.92 31.74,44.92 32.38,44.28 33.02,44.28 34.29,45.55 52.7,45.55 54.61,43.65 66.03,43.65 v66.67,44.28
MR
  Top 0.254: R8.1 125.72,76.67 126.36,76.67 IC17.3
N$1  (via drill 0.61)
  Top 0.254: v20.95,33.49 22.22,32.22 24.76,32.22 25.39,31.58 25.39,25.23 24.76,24.6 v26.03,23.33 | v45.72,18.88 46.35,18.25 46.35,13.17 47.62,11.9 47.62,6.18 v44.45,3.01
  Bottom 0.254: v20.95,33.49 17.14,33.49 IC3.3 | v26.03,23.33 27.3,22.06 29.84,22.06 32.38,19.52 42.54,19.52 43.18,18.88 v45.72,18.88 | v44.45,3.01 43.81,2.38 22.22,2.38 17.14,7.46 17.14,8.73 15.87,10 SV1.10
N$2
  Top 0.254: IC3.4 15.24,30.31 13.97,29.04 13.97,11.9 14.6,11.27 14.6,7.46 15.24,6.82 17.14,6.82 17.14,8.73 18.41,10 SV1.12
N$3  (via drill 0.61)
  Top 0.254: v149.22,75.4 147.95,76.67 147.95,78.58 C2.1
  Bottom 0.254: C2.1 147.31,79.21 144.14,79.21 IC17.39 | v149.22,75.4 151.12,75.4 152.39,74.13 154.94,74.13 Q1.1
N$4
  Bottom 0.254: IC17.38 144.14,76.67 159.38,76.67 160.65,77.94 160.65,79.21 156.2,79.21 Q1.2 154.94,79.21 151.12,79.21 C1.2
N$5  (via drill 0.61)
  Top 0.254: v80,75.4 80,78.58 80.64,79.21 IC24.2
  Bottom 0.254: v80,75.4 75.56,75.4 74.29,76.67 70.48,76.67 IC25.2
N$6
  Top 0.254: IC18.5 144.78,13.81 144.78,15.08 IC18.4 144.78,16.34 144.78,17.61 IC18.3
N$7  (via drill 0.61)
  Top 0.254: v19.04,23.33 19.04,16.98 19.68,16.34 19.68,13.17 20.95,11.9 20.95,11.27 SV1.14
  Bottom 0.254: v19.04,23.33 17.14,23.33 IC3.7
N$8  (via drill 0.61)
  Top 0.254: v20.95,20.15 21.58,19.52 21.58,13.81 23.49,11.9 23.49,11.27 SV1.16
  Bottom 0.254: v20.95,20.15 16.5,20.15 IC3.8
N$9  (via drill 0.61)
  Top 0.254: v12.7,19.52 13.33,18.88 13.33,11.27 SV1.8
  Bottom 0.254: v12.7,19.52 6.98,19.52 5.71,20.79 4.44,20.79 IC2.8
N$10
  Top 0.254: IC2.7 3.8,22.7 5.08,21.42 5.08,11.9 4.44,11.27 4.44,7.46 5.08,6.82 9.52,6.82 9.52,8.73 10.79,10 SV1.6
N$11  (via drill 0.61)
  Top 0.254: v12.7,29.68 12.7,25.23 12.06,24.6 8.89,24.6 8.89,15.08 8.25,14.44 8.25,11.27 SV1.4
  Bottom 0.254: v12.7,29.68 4.44,29.68 3.8,30.31 IC2.4
N$12
  Top 0.254: IC2.3 3.8,32.85 6.98,29.68 6.98,23.33 5.71,22.06 5.71,11.27 SV1.2
N$13  (via drill 0.61)
  Top 0.254: v6.98,20.79 6.34,20.15 6.34,13.81 6.98,13.17 6.98,8.73 6.34,8.09 SV1.1
  Bottom 0.254: v6.98,20.79 9.52,20.79 IC2.13
N$14  (via drill 0.61)
  Top 0.254: v5.71,23.33 4.44,24.6 1.27,24.6 1.27,10.63 v2.54,9.36
  Bottom 0.254: v5.71,23.33 9.52,23.33 IC2.14 | v2.54,9.36 6.34,9.36 6.98,8.73 6.98,8.09 7.62,8.09 SV1.3
N$15  (via drill 0.61)
  Top 0.254: v10.79,2.38 10.79,7.46 SV1.5 | v46.35,2.38 v47.62,3.64 | v12.7,37.3 12.7,31.58 12.06,30.95 IC2.17
  Bottom 0.254: v10.79,2.38 11.43,1.74 45.72,1.74 v46.35,2.38 | v47.62,3.64 48.89,2.38 82.55,2.38 95.24,15.08 104.77,15.08 107.94,18.25 107.94,23.96 103.5,23.96 97.78,29.68 97.78,31.58 99.05,32.85 99.05,34.12 98.42,34.76 92.7,34.76 85.08,42.38 71.75,42.38 70.48,41.11 45.08,41.11 44.45,40.48 11.43,40.48 10.79,39.84 8.25,39.84 6.98,38.57 6.98,37.3 v12.7,37.3
N$16
  Bottom 0.254: IC2.18 9.52,33.49 8.25,32.22 1.9,32.22 1.27,31.58 1.27,11.9 11.43,11.9 12.06,11.27 12.06,8.73 13.33,8.73 SV1.7
N$17
  Top 0.254: IC3.13 22.86,21.42 19.68,24.6 17.77,24.6 17.77,11.9 17.14,11.27 17.14,10 15.87,8.73 SV1.9
N$18  (via drill 0.61)
  Top 0.254: v19.68,11.9 19.68,8.73 19.04,8.09 SV1.11 | v24.76,11.9 24.76,14.44 25.39,15.08 25.39,21.42 24.76,22.06 24.76,23.33 IC3.14
  Bottom 0.254: v19.68,11.9 v24.76,11.9
N$19  (via drill 0.61)
  Top 0.254: v32.38,6.18 34.29,4.28 38.1,4.28 38.73,3.64 40,3.64 v40,4.92 | v86.35,7.46 86.35,9.36 85.08,10.63 85.08,30.95 86.35,32.22 v86.35,44.92
  Bottom 0.254: v32.38,6.18 29.2,6.18 28.57,6.82 21.58,6.82 20.95,7.46 SV1.13 | v40,4.92 40.64,4.28 46.98,4.28 47.62,4.92 49.53,3.01 81.91,3.01 v86.35,7.46 | v86.35,44.92 80.64,44.92 78.73,43.02 71.11,43.02 69.84,41.74 44.45,41.74 43.81,41.11 10.79,41.11 10.16,40.48 7.62,40.48 6.34,39.2 6.34,36.66 7.62,36.66 9.52,34.76 24.76,34.76 25.39,34.12 25.39,30.95 24.76,30.95 IC3.17
N$20  (via drill 0.61)
  Top 0.254: v26.03,24.6 26.03,32.22 24.76,33.49 IC3.18 | v76.19,6.82 v76.19,22.06 | v50.16,4.92 47.62,4.92 44.45,1.74 23.49,1.74 23.49,7.46 SV1.15
  Bottom 0.254: v26.03,24.6 32.38,24.6 34.92,22.06 42.54,22.06 43.18,21.42 46.98,21.42 47.62,22.06 55.24,22.06 55.88,22.7 59.69,22.7 60.32,22.06 v76.19,22.06 | v76.19,6.82 80.64,6.82 81.91,5.55 80.64,4.28 50.8,4.28 v50.16,4.92
N$21
  Top 0.254: 142.87,6.18 C3.1 142.87,6.18 | IC18.1 144.14,23.33 143.5,23.33 R1.1 142.87,22.7 141.6,21.42 141.6,20.15 142.23,19.52 142.23,8.09 142.23,6.82 142.87,6.18
N$22
  Top 0.254: R2.1 143.5,20.79 144.14,20.79 IC18.2 146.04,21.42 147.31,22.7 147.31,23.96 146.68,24.6 142.23,24.6 140.97,23.33 140.97,16.34 JP1.2
N$23  (via drill 0.61)
  Top 0.254: IC21.3 102.23,65.88 102.23,64.61 IC21.4 | v111.12,15.71 111.12,41.11 109.85,42.38 v109.85,50 | v104.77,50 106.67,51.91 106.67,52.54 106.04,53.17 106.04,65.88 v106.67,66.51
  Bottom 0.254: v111.12,15.71 113.66,15.71 IC27.5 | v109.85,50 109.21,49.37 105.41,49.37 v104.77,50 | v106.67,66.51 103.5,66.51 IC21.3
N$24  (via drill 0.61)
  Top 0.254: v49.53,48.09 48.26,48.09 45.72,50.63 45.72,74.77 47.62,76.67 IC26.2 | v79.37,48.09 80,48.73 80,51.91 80.64,52.54 80,53.17 80,58.89 80.64,58.89 IC24.10
  Bottom 0.254: v49.53,48.09 v79.37,48.09
N$25  (via drill 0.61)
  Top 0.254: v37.46,58.25 v37.46,75.4 | v35.55,50 v35.55,57.62
  Bottom 0.254: v37.46,75.4 45.08,75.4 45.72,74.77 48.26,74.77 IC26.3 | v37.46,58.25 36.83,57.62 v35.55,57.62 | v35.55,50 36.19,49.37 47.62,49.37 48.89,50.63 53.97,50.63 55.88,48.73 78.1,48.73 79.37,50 83.18,50 85.72,52.54 85.72,56.35 83.18,56.35 IC24.11
N$26  (via drill 0.61)
  Top 0.254: v52.07,119.85 52.07,110.33 52.7,109.69 IC11.2
  Bottom 0.254: 77.46,109.69 76.19,108.42 58.41,108.42 57.15,109.69 IC11.2 | 80.64,119.85 76.19,119.85 74.92,121.12 57.15,121.12 56.51,120.48 SV6.2 v52.07,119.85
N$27
  Top 0.254: 113.02,15.08 112.39,15.71 112.39,19.52 R11.A 113.02,21.42 114.3,22.7 IC27.2 | 113.02,15.08 114.3,13.81 IC27.6 | 113.02,15.08 113.02,10 113.66,9.36 113.66,6.82 123.19,6.82 124.45,8.09 C6.1
N$28
  Top 0.254: IC27.1 115.56,25.23 116.83,23.96 116.83,9.36 115.56,8.09 R9.1
  Bottom 0.254: R9.1 115.56,8.09 118.1,5.55 121.91,5.55 R10.2
N$29  (via drill 0.61)
  Top 0.254: v44.45,33.49 44.45,37.3 45.08,37.94 v45.08,39.84 | v83.81,6.18 v83.81,39.84
  Bottom 0.254: v44.45,33.49 42.54,33.49 IC9.3 | v45.08,39.84 45.72,40.48 71.11,40.48 71.75,39.84 v83.81,39.84 | v83.81,6.18 81.27,3.64 50.16,3.64 48.26,5.55 46.98,5.55 45.08,7.46 45.08,8.73 44.45,9.36 41.91,9.36 41.27,10 SV2.10
N$30  (via drill 0.61)
  Top 0.254: v56.51,32.22 56.51,23.33 55.24,22.06 52.7,22.06 52.07,21.42 52.07,14.44 52.7,13.81 v52.7,11.9
  Bottom 0.254: v56.51,32.22 47.62,32.22 46.98,31.58 41.91,31.58 IC9.4 | v52.7,11.9 48.26,11.9 47.62,11.27 47.62,10 46.98,9.36 45.72,9.36 45.08,10 43.81,10 SV2.12
N$31  (via drill 0.61)
  Top 0.254: v44.45,23.33 44.45,18.88 45.72,17.61 45.72,12.54 46.35,11.9 46.35,11.27 SV2.14
  Bottom 0.254: v44.45,23.33 42.54,23.33 IC9.7
N$32  (via drill 0.61)
  Top 0.254: v46.35,20.15 46.98,19.52 46.98,13.81 48.89,11.9 48.89,11.27 SV2.16
  Bottom 0.254: v46.35,20.15 41.91,20.15 IC9.8
N$33  (via drill 0.61)
  Top 0.254: v31.11,92.55 30.47,93.18 30.47,100.16 29.84,100.8 26.66,100.8 26.66,107.78 27.3,108.42 30.47,108.42 30.47,117.31 SV4.1
  Bottom 0.254: v31.11,92.55 35.55,92.55 IC8.12
N$34
  Top 0.254: IC8.15 35.55,98.89 33.65,96.99 32.38,96.99 32.38,116.67 SV4.3
N$35
  Top 0.254: IC8.16 35.55,102.7 34.29,103.97 34.29,117.31 SV4.5
N$36
  Top 0.254: IC8.19 36.83,110.33 38.1,111.59 38.1,117.31 SV4.7
N$37
  Top 0.254: IC4.3 29.84,33.49 31.74,33.49 31.74,29.68 31.11,29.04 31.11,11.27 SV2.2
N$38  (via drill 0.61)
  Top 0.254: v33.65,30.95 33.65,11.27 SV2.4
  Bottom 0.254: v33.65,30.95 29.84,30.95 IC4.4
N$39  (via drill 0.61)
  Top 0.254: v26.03,8.73 26.03,22.06 27.3,23.33 IC4.7
  Bottom 0.254: v26.03,8.73 26.66,9.36 34.29,9.36 34.92,10 34.92,10.63 35.55,10.63 SV2.6
N$40  (via drill 0.61)
  Top 0.254: v29.84,11.9 30.47,12.54 30.47,20.15 29.84,20.79 IC4.8
  Bottom 0.254: v29.84,11.9 38.1,11.9 38.73,11.27 SV2.8
N$41  (via drill 0.61)
  Top 0.254: v46.35,32.85 46.98,32.22 46.98,21.42 47.62,20.79 IC9.13 | v38.73,12.54 v38.73,32.22
  Bottom 0.254: v46.35,32.85 46.35,32.22 v38.73,32.22 | v38.73,12.54 40,11.27 40,8.09 40.64,8.09 SV2.9
N$42  (via drill 0.61)
  Top 0.254: v43.18,24.6 43.18,23.33 43.81,22.7 43.81,18.25 45.08,16.98 45.08,8.73 44.45,8.09 SV2.11
  Bottom 0.254: v43.18,24.6 44.45,24.6 45.08,23.96 48.26,23.96 IC9.14
N$43  (via drill 0.61)
  Top 0.254: v45.08,6.18 45.08,7.46 45.72,8.09 SV2.13 | v40,6.18 40,12.54 39.37,13.17 39.37,26.5 40,27.14 45.08,27.14 v45.08,30.31
  Bottom 0.254: v40,6.18 v45.08,6.18 | v45.08,30.31 45.08,30.95 47.62,30.95 IC9.17
N$44
  Top 0.254: IC9.18 49.53,32.85 50.8,31.58 50.8,10.63 48.89,8.73 SV2.15
N$45  (via drill 0.61)
  Top 0.254: v32.38,20.79 32.38,9.36 31.74,8.73 31.74,8.09 SV2.1
  Bottom 0.254: v32.38,20.79 34.92,20.79 IC4.13
N$46
  Top 0.254: IC4.14 36.83,22.7 38.1,21.42 38.1,13.17 37.46,12.54 37.46,7.46 36.83,6.82 33.65,6.82 33.65,7.46 SV2.3
N$47
  Top 0.254: IC4.17 35.55,30.31 34.29,29.04 34.29,11.9 34.92,11.27 34.92,10 36.19,8.73 SV2.5
N$48  (via drill 0.61)
  Top 0.254: v38.73,4.92 38.73,7.46 SV2.7 | v27.93,4.92 27.93,13.81 26.66,15.08 26.66,21.42 27.3,22.06 29.84,22.06 30.47,22.7 v30.47,32.22
  Bottom 0.254: v27.93,4.92 v38.73,4.92 | v30.47,32.22 31.74,32.22 33.02,33.49 34.92,33.49 IC4.18
N$49
  Top 0.254: IC8.5 29.2,102.7 31.11,104.61 31.11,117.94 32.38,119.22 SV4.4
N$50
  Top 0.254: IC8.6 27.3,99.53 26.03,99.53 26.03,119.22 25.39,119.85 25.39,121.12 27.93,123.66 34.92,123.66 34.92,120.48 SV4.6
N$51  (via drill 0.61)
  Top 0.254: v26.66,119.85 26.66,110.33 27.3,109.69 IC8.2
  Bottom 0.254: v26.66,119.85 29.2,119.85 SV4.2
N$52  (via drill 0.61)
  Top 0.254: v58.41,90 58.41,96.99 55.88,99.53 55.88,101.44 56.51,102.07 56.51,115.41 57.78,116.67 v57.78,124.93 | v37.46,124.3 37.46,120.48 SV4.8
  Bottom 0.254: v58.41,90 55.88,90 55.24,90.64 34.92,90.64 34.29,91.28 29.2,91.28 IC8.9 | v57.78,124.93 57.15,124.3 41.91,124.3 41.27,124.93 38.1,124.93 v37.46,124.3
N$53  (via drill 0.61)
  Top 0.254: v5.71,92.55 5.71,116.67 SV3.1
  Bottom 0.254: v5.71,92.55 10.16,92.55 IC6.12
N$54
  Top 0.254: IC6.15 10.16,100.16 8.25,102.07 8.25,116.67 SV3.3
N$55
  Top 0.254: IC6.16 10.16,102.7 8.89,103.97 8.89,114.77 10.79,116.67 SV3.5
N$56
  Top 0.254: IC6.19 11.43,110.33 13.33,112.23 13.33,116.67 SV3.7
N$57  (via drill 0.61)
  Top 0.254: v2.54,119.85 1.27,118.58 1.27,110.33 1.9,109.69 IC6.2
  Bottom 0.254: v2.54,119.85 5.08,119.85 SV3.2
N$58  (via drill 0.61)
  Top 0.254: v6.98,102.07 7.62,102.7 7.62,116.04 6.98,116.67 6.98,117.94 7.62,118.58 8.25,118.58 8.25,119.22 SV3.4
  Bottom 0.254: v6.98,102.07 4.44,102.07 IC6.5
N$59
  Top 0.254: IC6.6 3.8,100.16 5.08,101.44 5.08,116.04 4.44,116.67 4.44,120.48 5.08,121.12 10.79,121.12 10.79,120.48 SV3.6
N$60  (via drill 0.61)
  Top 0.254: v5.08,84.29 5.08,91.28 4.44,91.91 IC6.9 | v93.34,83.66 94.61,84.92 94.61,112.23 93.34,113.5 v93.34,123.66 | v13.33,125.56 13.33,120.48 SV3.8
  Bottom 0.254: v5.08,84.29 38.73,84.29 39.37,84.92 40,84.92 41.27,83.66 53.34,83.66 53.97,83.02 60.96,83.02 61.59,83.66 74.29,83.66 74.92,83.02 88.89,83.02 89.53,83.66 v93.34,83.66 | v93.34,123.66 92.7,123.03 88.26,123.03 85.08,126.2 13.97,126.2 v13.33,125.56
N$61
  Top 0.254: IC7.19 22.86,110.33 21.58,111.59 21.58,116.04 22.86,117.31 SV3.15
N$62
  Top 0.254: IC7.16 22.86,102.7 21.58,103.97 21.58,110.33 20.95,110.96 20.95,116.67 SV3.13
N$63  (via drill 0.61)
  Top 0.254: v18.41,99.53 18.41,116.67 SV3.11
  Bottom 0.254: v18.41,99.53 22.22,99.53 IC7.15
N$64  (via drill 0.61)
  Top 0.254: v18.41,92.55 18.41,96.99 17.14,98.26 13.97,98.26 13.97,100.8 13.33,101.44 13.33,104.61 12.7,105.25 v12.7,108.42 | v15.87,114.14 15.87,116.67 SV3.9
  Bottom 0.254: v18.41,92.55 22.86,92.55 IC7.12 | v12.7,108.42 1.9,108.42 1.27,109.05 1.27,113.5 3.17,113.5 3.8,114.14 v15.87,114.14
N$65
  Top 0.254: IC7.2 15.24,110.33 13.97,111.59 13.97,116.04 14.6,116.67 14.6,117.94 15.87,119.22 SV3.10
N$66
  Top 0.254: IC7.5 16.5,102.7 17.77,103.97 17.77,116.04 17.14,116.67 17.14,117.94 18.41,119.22 SV3.12
N$67
  Top 0.254: IC7.6 17.14,99.53 18.41,98.26 19.68,98.26 19.68,103.97 19.04,104.61 19.04,116.04 19.68,116.67 19.68,117.94 20.95,119.22 SV3.14
N$68  (via drill 0.61)
  Top 0.254: v23.49,114.14 23.49,114.77 24.76,116.04 24.76,117.94 24.12,118.58 24.12,119.85 SV3.16 | v38.73,108.42 38.73,99.53 39.37,98.89 v39.37,83.66 | v18.41,83.02 17.77,83.66 17.77,91.28 17.14,91.91 IC7.9
  Bottom 0.254: v23.49,114.14 24.12,114.14 24.76,113.5 29.84,113.5 34.92,108.42 v38.73,108.42 | v39.37,83.66 19.04,83.66 v18.41,83.02
N$69
  Top 0.254: IC10.2 40,109.69 38.73,109.69 38.73,117.94 40,119.22 SV4.10
N$70
  Top 0.254: IC10.5 42.54,102.07 43.81,103.34 43.81,117.94 42.54,119.22 SV4.12
N$71  (via drill 0.61)
  Top 0.254: v33.65,98.26 v33.65,121.12
  Bottom 0.254: v33.65,121.12 44.45,121.12 45.08,120.48 SV4.14 | v33.65,98.26 38.1,98.26 39.37,99.53 40,99.53 IC10.6
N$72  (via drill 0.61)
  Top 0.254: v44.45,91.91 44.45,98.89 45.08,99.53 45.08,100.16 44.45,100.8 44.45,114.77 46.35,116.67 46.35,117.94 46.98,118.58 47.62,118.58 47.62,119.22 SV4.16
  Bottom 0.254: v44.45,91.91 42.54,91.91 IC10.9
N$73  (via drill 0.61)
  Top 0.254: v45.72,109.69 45.72,114.77 46.98,116.04 46.98,117.31 SV4.15
  Bottom 0.254: v45.72,109.69 47.62,109.69 IC10.19
N$74
  Top 0.254: IC10.16 48.26,102.7 46.98,103.97 46.98,110.33 46.35,110.96 46.35,114.14 48.89,116.67 48.89,120.48 48.26,121.12 46.35,121.12 46.35,119.22 45.08,117.94 SV4.13
N$75  (via drill 0.61)
  Top 0.254: v50.16,117.31 49.53,116.67 49.53,115.41 46.98,112.86 46.98,111.59 47.62,110.96 50.8,110.96 50.8,100.16 50.16,99.53 IC10.15
  Bottom 0.254: v50.16,117.31 48.89,116.04 43.18,116.04 42.54,116.67 SV4.11
N$76  (via drill 0.61)
  Top 0.254: v50.16,121.12 50.16,118.58 51.43,117.31 51.43,99.53 50.8,98.89 50.8,92.55 50.16,91.91 IC10.12
  Bottom 0.254: v50.16,121.12 46.98,121.12 46.35,120.48 46.35,119.22 45.72,118.58 41.27,118.58 40.64,117.94 40,117.94 SV4.9
N$77
  Top 0.254: IC16.3 66.03,32.85 64.77,31.58 64.77,15.08 66.67,13.17 66.67,11.27 SV5.10
N$78
  Top 0.254: IC16.4 67.3,30.31 68.57,29.04 68.57,18.25 69.84,16.98 69.84,10.63 SV5.12
N$79  (via drill 0.61)
  Top 0.254: v70.48,23.33 70.48,20.15 71.75,18.88 71.75,11.27 SV5.14
  Bottom 0.254: v70.48,23.33 67.94,23.33 IC16.7
N$80  (via drill 0.61)
  Top 0.254: v71.75,20.15 72.38,19.52 72.38,14.44 74.29,12.54 74.29,11.27 SV5.16
  Bottom 0.254: v71.75,20.15 67.3,20.15 IC16.8
N$81  (via drill 0.61)
  Top 0.254: v57.15,86.19 v57.15,91.91 | v21.58,86.19 21.58,100.16 22.22,100.8 25.39,100.8 25.39,114.14 v24.76,114.77
  Bottom 0.254: v57.15,91.91 60.32,91.91 IC11.12 | v57.15,86.19 43.81,86.19 43.18,86.83 31.11,86.83 30.47,86.19 v21.58,86.19 | v24.76,114.77 25.39,114.14 41.27,114.14 42.54,115.41 49.53,115.41 51.43,117.31 55.88,117.31 SV6.1
N$82
  Top 0.254: IC11.15 60.32,99.53 57.78,99.53 57.78,115.41 59.05,116.67 SV6.3
N$83
  Top 0.254: IC11.16 60.96,102.7 59.69,103.97 59.69,114.77 61.59,116.67 SV6.5
N$84
  Top 0.254: IC11.19 62.23,110.33 64.13,112.23 64.13,116.67 SV6.7
N$85  (via drill 0.61)
  Top 0.254: v85.08,77.94 85.08,91.28 85.72,91.91 IC13.12 | v93.97,77.94 95.24,79.21 95.24,112.86 94.61,113.5 v94.61,114.14 | v81.91,115.41 81.91,116.67 SV7.1
  Bottom 0.254: v85.08,77.94 85.72,78.58 93.34,78.58 v93.97,77.94 | v94.61,114.14 93.97,114.77 88.26,114.77 87.62,115.41 v81.91,115.41
N$86  (via drill 0.61)
  Top 0.254: v83.81,100.16 84.45,100.8 84.45,116.67 SV7.3
  Bottom 0.254: v83.81,100.16 86.35,100.16 IC13.15
N$87  (via drill 0.61)
  Top 0.254: v109.21,105.88 109.85,106.52 109.85,122.39 109.21,123.03 v109.21,124.3 | v88.26,124.3 88.26,118.58 87.62,117.94 87.62,117.31 SV7.5
  Bottom 0.254: v109.21,105.88 102.86,105.88 102.86,103.97 103.5,103.34 100.96,100.8 89.53,100.8 88.89,101.44 87.62,101.44 IC13.16 | v109.21,124.3 109.21,126.2 90.16,126.2 v88.26,124.3
N$88
  Top 0.254: IC13.19 87.62,110.33 89.53,112.23 89.53,116.67 SV7.7
N$89  (via drill 0.61)
  Top 0.254: v55.24,122.39 55.24,116.67 55.88,116.04 55.88,102.7 55.24,102.07 IC11.5 | v59.05,122.39 59.05,120.48 SV6.4
  Bottom 0.254: v55.24,122.39 v59.05,122.39
N$90  (via drill 0.61)
  Top 0.254: v43.81,99.53 42.54,100.8 39.37,100.8 39.37,102.7 40,103.34 42.54,103.34 43.18,103.97 43.18,110.33 42.54,110.96 39.37,110.96 39.37,114.77 41.27,116.67 v41.27,123.66 | v61.59,123.66 61.59,120.48 SV6.6
  Bottom 0.254: v43.81,99.53 44.45,99.53 45.72,98.26 50.8,98.26 51.43,98.89 53.34,98.89 IC11.6 | v41.27,123.66 v61.59,123.66
N$91  (via drill 0.61)
  Top 0.254: v58.41,85.56 58.41,84.92 57.15,84.92 55.88,86.19 55.88,91.28 55.24,91.91 IC11.9 | v73.66,85.56 73.66,86.19 76.19,88.73 v76.19,90.64 | v112.39,90.64 112.39,92.55 111.75,93.18 111.75,114.77 113.02,116.04 113.02,119.85 111.75,121.12 111.75,123.03 108.58,126.2 64.13,126.2 64.13,120.48 SV6.8
  Bottom 0.254: v58.41,85.56 60.96,85.56 61.59,84.92 73.02,84.92 v73.66,85.56 | v76.19,90.64 v112.39,90.64
N$92  (via drill 0.61)
  Top 0.254: v67.94,122.39 67.94,117.94 67.3,117.31 SV6.9 | v76.19,110.96 v76.19,121.12 | v69.84,110.33 69.84,107.15 71.75,105.25 71.75,102.07 72.38,101.44 72.38,96.36 73.02,95.72 76.19,95.72 76.19,92.55 75.56,91.91 IC12.12
  Bottom 0.254: v67.94,122.39 68.57,121.75 75.56,121.75 v76.19,121.12 | v76.19,110.96 71.11,110.96 70.48,110.33 v69.84,110.33
N$93  (via drill 0.61)
  Top 0.254: v82.55,114.14 82.55,109.69 83.18,109.05 83.18,107.15 81.91,105.88 81.91,100.16 81.27,99.53 81.27,97.62 81.91,96.99 v81.91,87.47 | v69.84,87.47 v69.84,99.53
  Bottom 0.254: v82.55,114.14 71.75,114.14 69.21,116.67 SV6.11 | v69.84,87.47 v81.91,87.47 | v69.84,99.53 73.02,99.53 IC12.15
N$94  (via drill 0.61)
  Top 0.254: v40,56.35 40.64,56.35 40.64,66.51 39.37,67.78 39.37,69.69 38.73,70.32 v38.73,72.86
  Bottom 0.254: v40,56.35 40.64,56.35 41.91,55.08 45.08,55.08 46.98,53.17 51.43,53.17 52.07,53.81 80.64,53.81 IC24.12 | v38.73,72.86 45.72,72.86 46.98,71.59 47.62,71.59 IC26.4
N$95
  Top 0.254: IC12.16 73.66,102.7 72.38,103.97 72.38,110.33 71.75,110.96 71.75,116.67 SV6.13
N$96
  Top 0.254: IC12.19 73.66,110.33 72.38,111.59 72.38,114.77 74.29,116.67 SV6.15
N$97
  Top 0.254: IC12.2 66.03,110.33 64.77,111.59 64.77,116.04 65.4,116.67 65.4,117.94 66.67,119.22 SV6.10
N$98  (via drill 0.61)
  Top 0.254: v67.94,116.04 68.57,115.41 68.57,102.7 67.94,102.07 IC12.5
  Bottom 0.254: v67.94,116.04 67.94,117.94 69.21,119.22 SV6.12
N$99  (via drill 0.61)
  Top 0.254: v77.46,118.58 77.46,110.96 76.19,109.69 v76.19,98.26
  Bottom 0.254: v77.46,118.58 72.38,118.58 71.75,119.22 SV6.14 | v76.19,98.26 69.21,98.26 68.57,98.89 67.3,98.89 IC12.6
N$100  (via drill 0.61)
  Top 0.254: v68.57,88.1 68.57,91.28 67.94,91.91 IC12.9 | v83.18,88.73 82.55,89.37 82.55,105.25 83.81,106.52 83.81,116.04 83.18,116.67 v83.18,123.66 | v74.29,123.66 74.29,120.48 SV6.16
  Bottom 0.254: v68.57,88.1 69.21,88.73 72.38,88.73 73.02,88.1 81.27,88.1 81.91,88.73 v83.18,88.73 | v83.18,123.66 v74.29,123.66
N$101
  Top 0.254: IC15.3 55.24,33.49 55.24,34.12 59.05,34.12 59.05,23.33 56.51,20.79 56.51,11.27 SV5.2
N$102  (via drill 0.61)
  Top 0.254: v52.07,10 52.07,11.27 51.43,11.9 51.43,29.68 52.7,30.95 IC15.4
  Bottom 0.254: v52.07,10 55.24,10 55.88,9.36 57.15,9.36 57.78,10 59.05,10 SV5.4
N$103  (via drill 0.61)
  Top 0.254: v85.08,9.36 84.45,10 84.45,31.58 v85.08,32.22 | v57.78,32.22 56.51,33.49 55.88,33.49 55.88,32.85 55.24,32.22 55.88,31.58 55.88,23.96 55.24,23.33 IC15.7
  Bottom 0.254: v85.08,9.36 62.23,9.36 61.59,10 SV5.6 | v85.08,32.22 v57.78,32.22
N$104  (via drill 0.61)
  Top 0.254: v55.24,11.9 55.88,12.54 55.88,20.15 55.24,20.79 IC15.8
  Bottom 0.254: v55.24,11.9 63.5,11.9 64.13,11.27 SV5.8
N$105  (via drill 0.61)
  Top 0.254: v68.57,16.98 68.57,11.9 67.94,11.27 67.94,9.36 67.3,8.73 67.3,8.09 SV5.9
  Bottom 0.254: v68.57,16.98 75.56,16.98 76.19,17.61 76.19,18.88 74.92,20.15 IC16.13
N$106
  Top 0.254: IC16.14 73.02,23.33 71.75,23.33 70.48,24.6 69.21,24.6 69.21,18.88 70.48,17.61 70.48,10 69.21,8.73 SV5.11
N$107  (via drill 0.61)
  Top 0.254: v81.27,29.04 81.27,27.14 82.55,25.87 82.55,13.81 v81.27,12.54 | v73.02,12.54 73.02,9.36 72.38,8.73 72.38,8.09 SV5.13
  Bottom 0.254: v81.27,29.04 76.19,29.04 74.92,30.31 IC16.17 | v73.02,12.54 v81.27,12.54
N$108
  Top 0.254: IC16.18 75.56,33.49 76.83,32.22 80.64,32.22 80.64,30.95 83.18,28.41 83.18,12.54 76.19,5.55 74.29,5.55 74.29,7.46 SV5.15
N$109  (via drill 0.61)
  Top 0.254: v57.78,20.79 57.78,9.36 57.15,8.73 57.15,8.09 SV5.1
  Bottom 0.254: v57.78,20.79 60.32,20.79 IC15.13
N$110